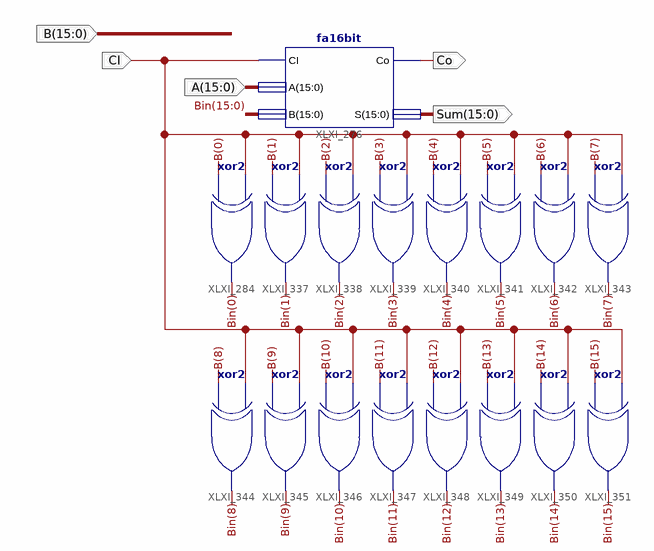
[diagram p0: schematic sheet 1]
// Xilinx ISE schematic two_complement_adder.sch (virtex6) as structural Verilog: 17 symbols, 5 ports
module two_complement_adder (
  input  CI,
  input  [15:0] A,
  input  [15:0] B,
  output [15:0] Sum,
  output Co
);

  wire [15:0] Bin;

  fa16bit XLXI_276 (.CI(CI), .A(A), .B(Bin), .Co(Co), .S(Sum));
  xor XLXI_284 (Bin[0], B[0], CI);
  xor XLXI_337 (Bin[1], B[1], CI);
  xor XLXI_338 (Bin[2], B[2], CI);
  xor XLXI_339 (Bin[3], B[3], CI);
  xor XLXI_340 (Bin[4], B[4], CI);
  xor XLXI_342 (Bin[6], B[6], CI);
  xor XLXI_343 (Bin[7], B[7], CI);
  xor XLXI_341 (Bin[5], B[5], CI);
  xor XLXI_344 (Bin[8], B[8], CI);
  xor XLXI_345 (Bin[9], B[9], CI);
  xor XLXI_346 (Bin[10], B[10], CI);
  xor XLXI_347 (Bin[11], B[11], CI);
  xor XLXI_348 (Bin[12], B[12], CI);
  xor XLXI_349 (Bin[13], B[13], CI);
  xor XLXI_350 (Bin[14], B[14], CI);
  xor XLXI_351 (Bin[15], B[15], CI);
endmodule
